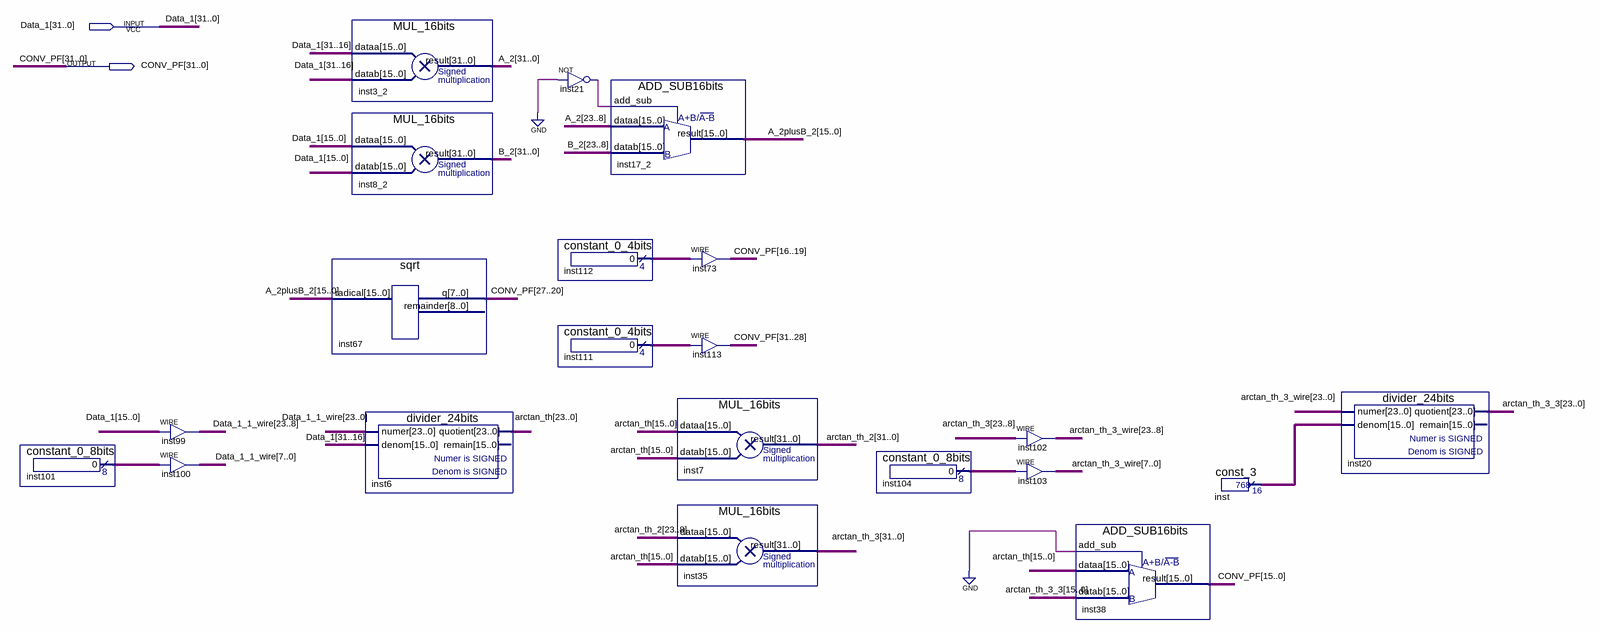
[diagram p0: schematic sheet]
// Quartus schematic exp_to_pf_converter.bdf as structural Verilog: 21 symbols, 2 pins
module exp_to_pf_converter (
  input  [31:0] Data_1,
  output [31:0] CONV_PF
);

  wire inst21_out;
  wire [3:0] inst111_result, inst112_result;
  wire [7:0] inst101_result, inst104_result;
  wire [15:0] A_2plusB_2, inst_result;
  wire [23:0] arctan_th, arctan_th_3_3, arctan_th_3_wire, Data_1_1_wire;
  wire [31:0] A_2, arctan_th_2, arctan_th_3, B_2;

  constant_0_8bits inst101 (.result(inst101_result));
  assign Data_1_1_wire[23:8] = Data_1[15:0];  // WIRE inst99
  assign Data_1_1_wire[7:0] = inst101_result;  // WIRE inst100
  MUL_16bits inst3_2 (.dataa(Data_1[31:16]), .datab(Data_1[31:16]), .result(A_2));
  MUL_16bits inst8_2 (.dataa(Data_1[15:0]), .datab(Data_1[15:0]), .result(B_2));
  sqrt inst67 (.radical(A_2plusB_2), .q(CONV_PF[27:20]));  // open: remainder
  divider_24bits inst6 (.numer(Data_1_1_wire), .denom(Data_1[31:16]), .quotient(arctan_th));  // open: remain
  not inst21 (inst21_out, 1'b0);
  constant_0_4bits inst112 (.result(inst112_result));
  constant_0_4bits inst111 (.result(inst111_result));
  ADD_SUB16bits inst17_2 (.add_sub(inst21_out), .dataa(A_2[23:8]), .datab(B_2[23:8]), .result(A_2plusB_2));
  assign {CONV_PF[16], CONV_PF[17], CONV_PF[18], CONV_PF[19]} = inst112_result;  // WIRE inst73
  assign CONV_PF[31:28] = inst111_result;  // WIRE inst113
  MUL_16bits inst7 (.dataa(arctan_th[15:0]), .datab(arctan_th[15:0]), .result(arctan_th_2));
  MUL_16bits inst35 (.dataa(arctan_th_2[23:8]), .datab(arctan_th[15:0]), .result(arctan_th_3));
  constant_0_8bits inst104 (.result(inst104_result));
  assign arctan_th_3_wire[23:8] = arctan_th_3[23:8];  // WIRE inst102
  assign arctan_th_3_wire[7:0] = inst104_result;  // WIRE inst103
  ADD_SUB16bits inst38 (.add_sub(1'b0), .dataa(arctan_th[15:0]), .datab(arctan_th_3_3[15:0]), .result(CONV_PF[15:0]));
  const_3 inst (.result(inst_result));
  divider_24bits inst20 (.numer(arctan_th_3_wire), .denom(inst_result), .quotient(arctan_th_3_3));  // open: remain
endmodule
